# Altium schematic sheet Ethernet.SchDoc
size A3
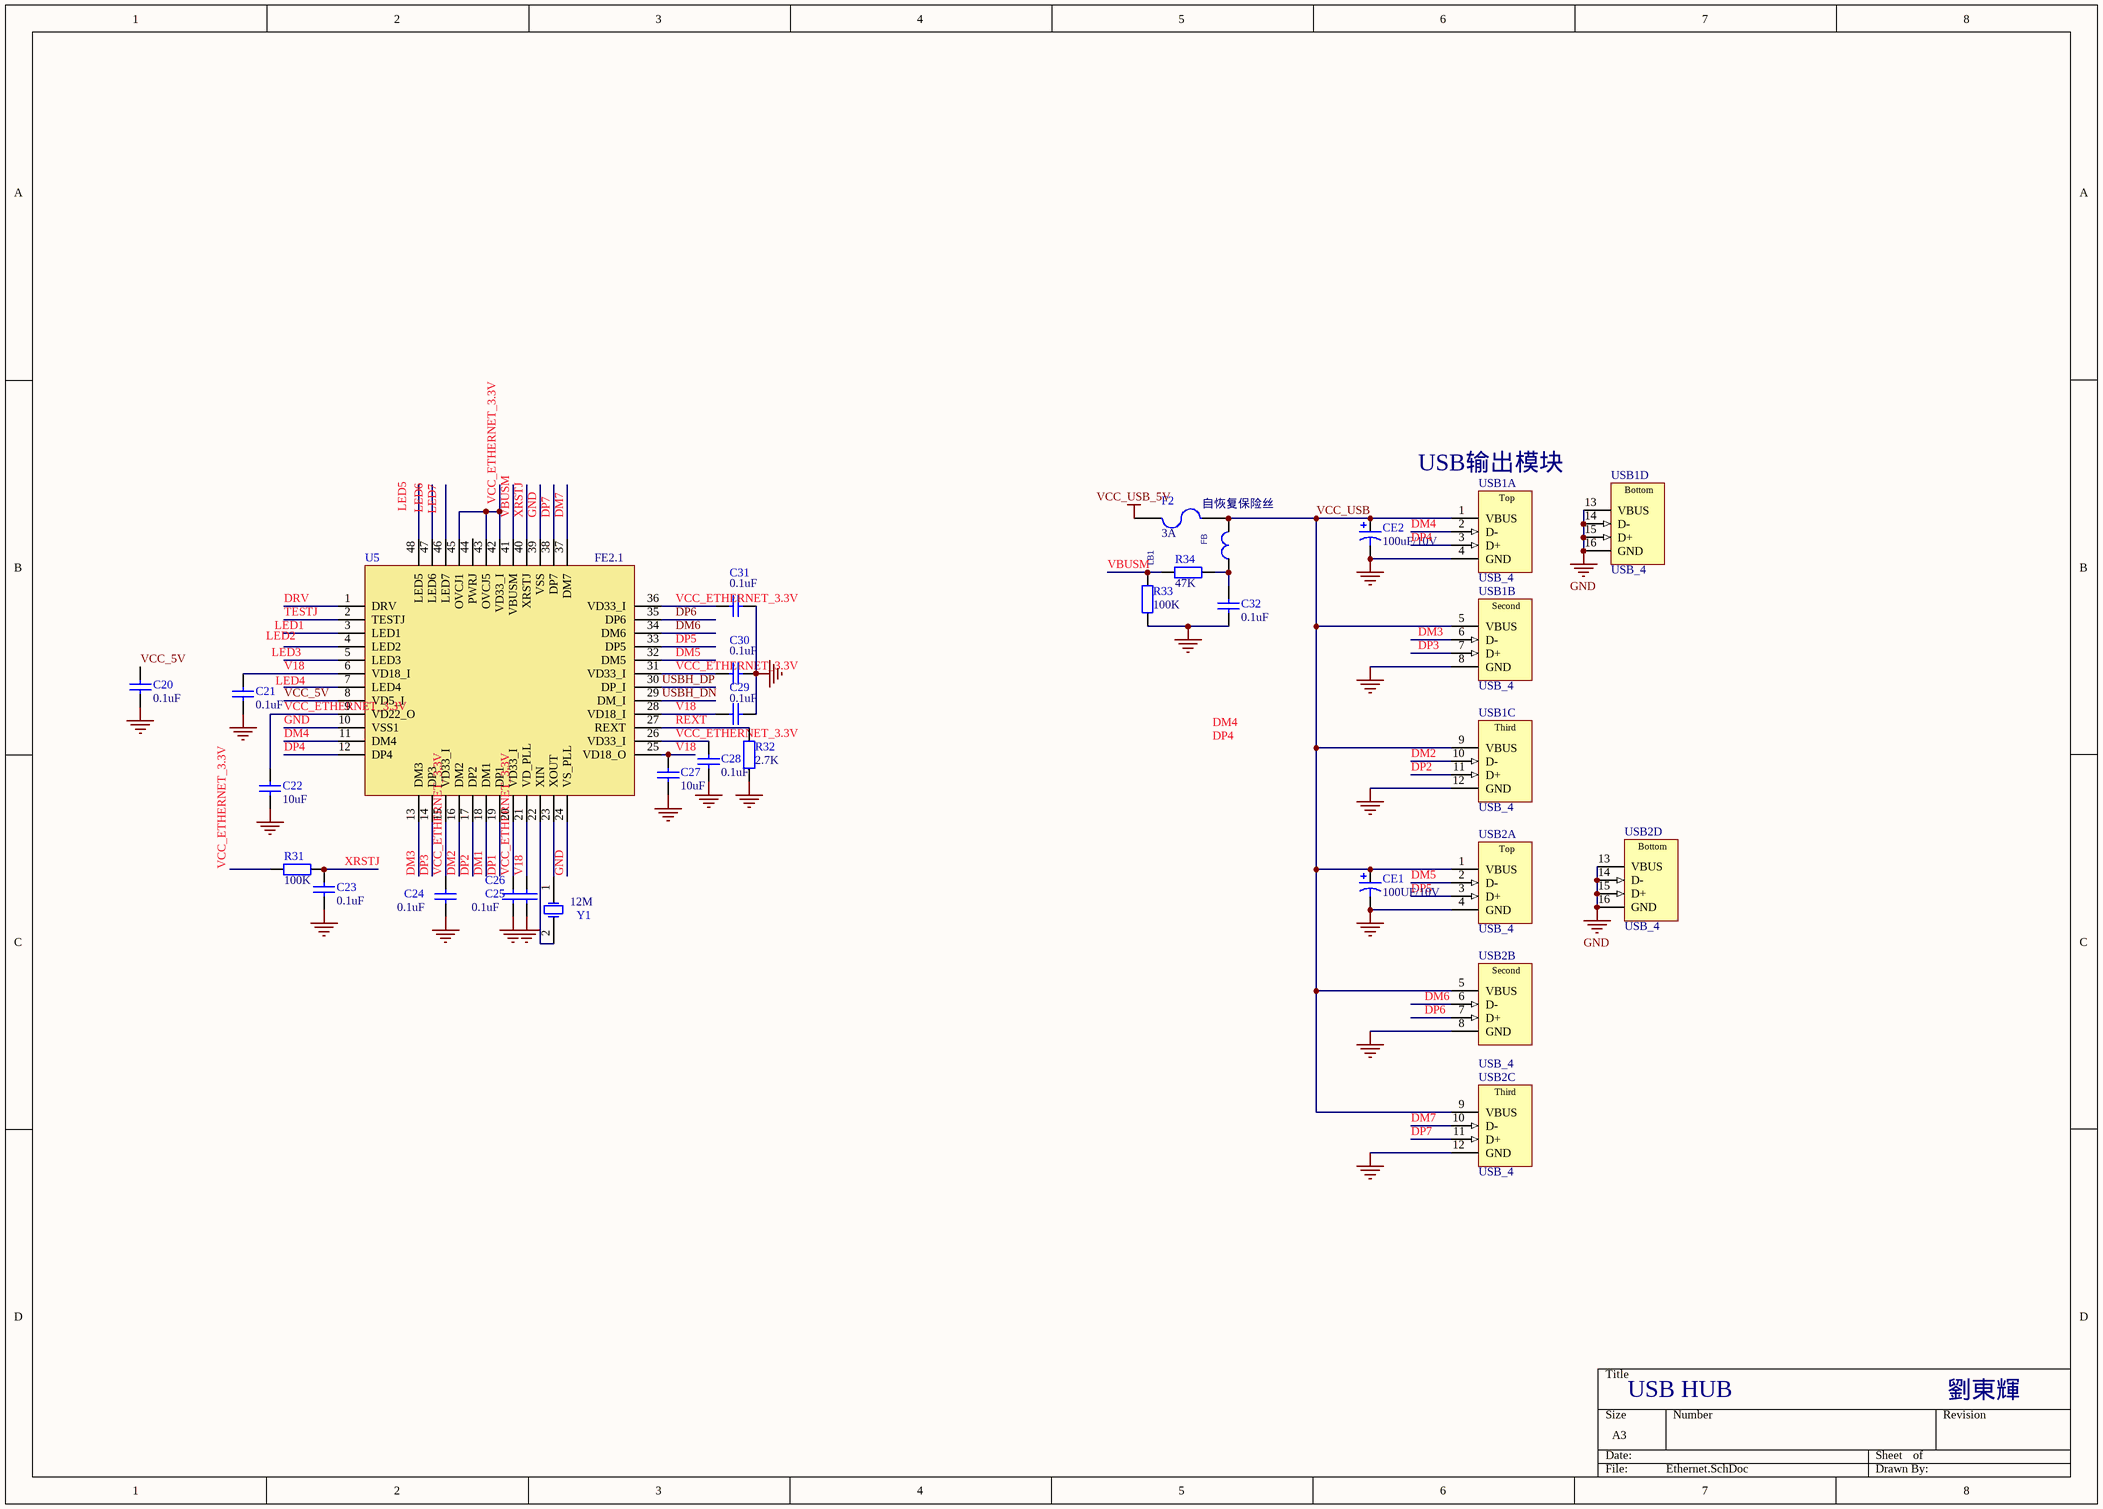
[diagram p0: Ethernet.SchDoc]

## Parts
C20  0.1uF  [0805/2012 C3]
C21  0.1uF  [0805/2012 C3]
C22  10uF  [0805/2012 C3]
C23  0.1uF  [0805/2012 C3]
C24  0.1uF  [0805/2012 C3]
C25  0.1uF  [0805/2012 C3]
C26  0.1uF  [0805/2012 C3]  (value not drawn)
C27  10uF  [0805/2012 C3]
C28  0.1uF  [0805/2012 C3]
C29  0.1uF  [0805/2012 C3]
C30  0.1uF  [0805/2012 C3]
C31  0.1uF  [0805/2012 C3]
C32  0.1uF  [0805/2012 C3]
CE1  100UF/10V  [2312_6023-20_SMT-TAJ-F]
CE2  100uF/10V  [2312_6023-20_SMT-TAJ-F]
F2  3A  [FUSR_BOURNS_MF-MSMF_STYLE1(H85)]
LB1  FB  [0805/2012 F3]
R31  100K  [0805/2012 R3]
R32  2.7K  [0805/2012 R3]
R33  100K  [0805/2012 R3]
R34  47K  [0805/2012 R3]
U5  FE2.1  [LQFP-48L]
USB1  USB_4  [USB-3]  (parts A,B,C,D of 5)
USB2  USB_4  [USB-3]  (parts A,B,C,D of 5)
Y1  12M  [XTAL_CITIZEN_HCM49]

## Nets
GND: C20.1 C21.1 C22.1 C23.1 C24.1 C25.1 C26.1 C27.1 C28.1 C29.1 C30.1 C31.1 C32.1 CE1.2 CE2.2 R32.1 R33.1 U5.10(VSS1) U5.24(VS_PLL) U5.39(VSS) USB1.4(GND) USB1.8(GND) USB1.12(GND) USB1.13(VBUS) USB1.14(D-) USB1.15(D+) USB1.16(GND) USB2.4(GND) USB2.8(GND) USB2.12(GND) USB2.13(VBUS) USB2.14(D-) USB2.15(D+) USB2.16(GND)
VCC_USB_5V: F2.2
DM1: U5.18(DM1)
DM2: U5.16(DM2) USB1.10(D-)
DM3: U5.13(DM3) USB1.6(D-)
DM4: U5.11(DM4) USB1.2(D-)
DM5: U5.32(DM5) USB2.2(D-)
DM6: U5.34(DM6) USB2.6(D-)
DM7: U5.37(DM7) USB2.10(D-)
DP1: U5.19(DP1)
DP2: U5.17(DP2) USB1.11(D+)
DP3: U5.14(DP3) USB1.7(D+)
DP4: U5.12(DP4) USB1.3(D+)
DP5: U5.33(DP5) USB2.3(D+)
DP6: U5.35(DP6) USB2.7(D+)
DP7: U5.38(DP7) USB2.11(D+)
DRV: U5.1(DRV)
REXT: R32.2 U5.27(REXT)
TESTJ: U5.2(TESTJ)
USBH_DN: U5.29(DM_I)
USBH_DP: U5.30(DP_I)
V18: C21.2 C26.2 C27.2 C29.2 U5.6(VD18_I) U5.21(VD_PLL) U5.25(VD18_O) U5.28(VD18_I)
VBUSM: R33.2 R34.2 U5.41(VBUSM)
VCC_5V: C20.2 U5.8(VD5_I)
VCC_ETHERNET_3.3V: C22.2 C24.2 C25.2 C28.2 C30.2 C31.2 R31.1 U5.9(VD22_O) U5.15(VD33_I) U5.20(VD33_I) U5.26(VD33_I) U5.31(VD33_I) U5.36(VD33_I) U5.42(VD33_I) U5.43(OVCJ5) U5.45(OVCJ1)
VCC_USB: CE1.1 CE2.1 F2.1 LB1.2 USB1.1(VBUS) USB1.5(VBUS) USB1.9(VBUS) USB2.1(VBUS) USB2.5(VBUS) USB2.9(VBUS)
XRSTJ: C23.2 R31.2 U5.40(XRSTJ)
NetC32_2: C32.2 LB1.1 R34.1
NetU5_22: U5.22(XIN) Y1.2(OSC2)
NetU5_23: U5.23(XOUT) Y1.1(OSC1)

Not connected (* = marked no-connect by the designer): U5 3(LED1) 4(LED2) 5(LED3) 7(LED4) 44(PWRJ) 46(LED7) 47(LED6) 48(LED5)

## Notes on the sheet
- (near F2) 自恢复保险丝
- (near USB1) USB输出模块
- USB HUB
- 劉東輝
- Labels drawn without touching a wire or pin: DM4, DP4, LED1, LED2, LED3, LED4, LED5, LED6, LED7
- (in symbol USB_4, part A) Top
- (in symbol USB_4, part B) Second
- (in symbol USB_4, part C) Third
- (in symbol USB_4, part D) Bottom

## Library data of the parts
C20-C32 = Cap: Capacitor
  C20-C22 C24 C27 C30: Published: *; LatestRevisionDate: *; LatestRevisionNote: *; PackageReference: *; Publisher: *; Value: *
  C23 C25 C26 C28 C29 C31 C32: Published: 8-Jun-2000; LatestRevisionDate: 17-Jul-2002; LatestRevisionNote: Re-released for DXP Platform.; PackageReference: RAD-0.3; Publisher: Altium Limited
CE1 CE2 = Cap Pol1: Polarized Capacitor (Radial)
  CE1: Published: 8-Jun-2000; LatestRevisionDate: 17-Jul-2002; LatestRevisionNote: Re-released for DXP Platform.; PackageReference: RB7.6-15; Publisher: Altium Limited
  CE2: Published: *; LatestRevisionDate: *; LatestRevisionNote: *; PackageReference: *; Publisher: *; Value: *
F2 = Fuse 2: Fuse; Published: 8-Jun-2000; LatestRevisionDate: 17-Jul-2002; LatestRevisionNote: Re-released for DXP Platform.; PackageReference: PIN-W2/E2.8; Publisher: Altium Limited
LB1 = FB-0805
R31-R34 = Res2: Resistor
  R31 R33 R34: Published: 8-Jun-2000; LatestRevisionDate: 17-Jul-2002; LatestRevisionNote: Re-released for DXP Platform.; PackageReference: AXIAL-0.4; Publisher: Altium Limited
  R32: Published: *; LatestRevisionDate: *; LatestRevisionNote: *; PackageReference: *; Publisher: *; Value: *
U5 = F2.1
USB1 USB2 = USB_4: USB 1.1, Right Angle, Thru-Hole, A Type, Receptacle, 4x4x4x4 Position, Fourfold Stacked, Black; ContactMaterial: Phosphor Bronze; ContactPlating: Gold (30) over Nickel (50); TerminationLength: 2.36mm [0.093in.]; PCB_Layout: Complies with manufacturer's recommendation.; DrillSize: Corresponds to nominal value.; PanelGround: Without; Published: 15-Jul-2004; DatasheetDocument: 30-Jul-2002; PackageDocument: 30-Jul-2002; PackageReference: 1470007; Publisher: Altium Limited; HousingMaterial: 30% Glass-Filled Thermoplastic; ComponentLink1Description: Manufacturer Link; ComponentLink1URL: http://www.tycoelectronics.com/; ComponentLink2Description: Packaging Specification; ComponentLink2URL: http://ecommas.tycoelectronics.com/commerce/DocumentDelivery/DDEController?Action=showdoc&DocId=Customer+Drawing%7F1470007%7FO%7Fpdf%7FEnglish%7FENG_CD_1470007_O.pdf
Y1 = XTAL: Crystal Oscillator; Published: *; LatestRevisionDate: *; LatestRevisionNote: *; PackageReference: *; Publisher: *